# Altium schematic sheet delay_width.SchDoc: Delay and Width Circuit
size Letter; Organization: NewAE Technology Inc.; Address1: 1083 Queen St., Suite 196; Address2: Halifax; Address3: NS; Address4: Canada B3H 0B2; SheetApproved: NO
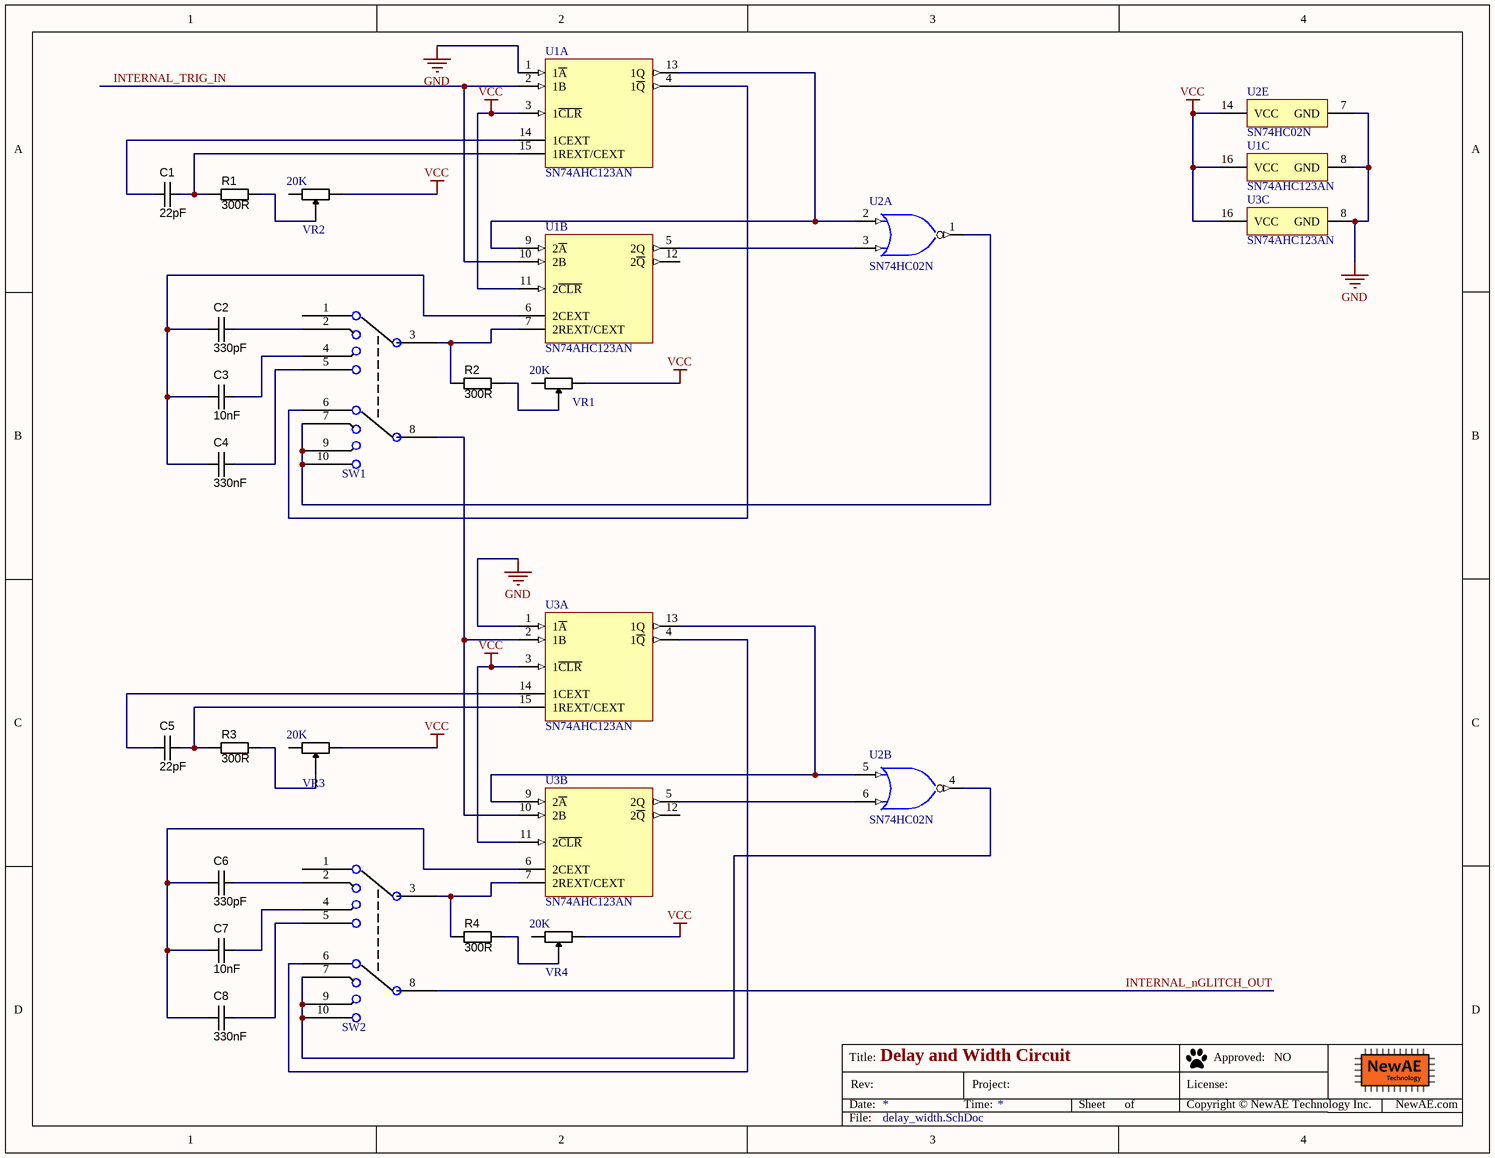
[diagram p0: delay_width.SchDoc]

## Parts
C1  value 22pF  [CAPC500P450250X550]  (hidden comment: approved sub OK)
C2  value 330pF  [CAPC500P450250X550]  (hidden comment: approved sub OK)
C3  value 10nF  [CAPC500P450250X550]  (hidden comment: approved sub OK)
C4  value 330nF  [CAPC500P450250X550]  (hidden comment: approved sub OK)
C5  value 22pF  [CAPC500P450250X550]  (hidden comment: approved sub OK)
C6  value 330pF  [CAPC500P450250X550]  (hidden comment: approved sub OK)
C7  value 10nF  [CAPC500P450250X550]  (hidden comment: approved sub OK)
C8  value 330nF  [CAPC500P450250X550]  (hidden comment: approved sub OK)
R1  value 300R  [RESTH_AXIAL-0.4]  (hidden comment: Carbon Film)
R2  value 300R  [RESTH_AXIAL-0.4]  (hidden comment: Carbon Film)
R3  value 300R  [RESTH_AXIAL-0.4]  (hidden comment: Carbon Film)
R4  value 300R  [RESTH_AXIAL-0.4]  (hidden comment: Carbon Film)
SW1  SS-24E06-TG 5 (P)  [CK_SS24E06TG5P]  (value not drawn)
SW2  SS-24E06-TG 5 (P)  [CK_SS24E06TG5P]  (value not drawn)
U1  SN74AHC123AN  [N0016A]  (parts A,B,C of 3)
U2  SN74HC02N  [N0014A]  (parts A,B,E of 5)
U3  SN74AHC123AN  [N0016A]  (parts A,B,C of 3)
VR1  20K  [RES_PDB18]
VR2  20K  [RES_PDB18]
VR3  20K  [RES_PDB18]
VR4  20K  [RES_PDB18]

## Nets
GND: U1.1(1~{A}) U1.8(GND) U2.7(GND) U3.1(1~{A}) U3.8(GND)
VCC: U1.3(1~{CLR}) U1.11(2~{CLR}) U1.16(VCC) U2.14(VCC) U3.3(1~{CLR}) U3.11(2~{CLR}) U3.16(VCC) VR1.1 VR2.1 VR3.1 VR4.1
INTERNAL_nGLITCH_OUT: SW2.8
INTERNAL_TRIG_IN: U1.2(1B) U1.10(2B)
NetC1_1: C1.1 U1.14(1CEXT)
NetC1_2: C1.2 R1.1 U1.15(1REXT/CEXT)
NetC2_1: C2.1 C3.1 C4.1 U1.6(2CEXT)
NetC2_2: C2.2 SW1.2
NetC3_2: C3.2 SW1.4
NetC4_2: C4.2 SW1.5
NetC5_1: C5.1 U3.14(1CEXT)
NetC5_2: C5.2 R3.1 U3.15(1REXT/CEXT)
NetC6_1: C6.1 C7.1 C8.1 U3.6(2CEXT)
NetC6_2: C6.2 SW2.2
NetC7_2: C7.2 SW2.4
NetC8_2: C8.2 SW2.5
NetR1_2: R1.2 VR2.2
NetR2_1: R2.1 SW1.3 U1.7(2REXT/CEXT)
NetR2_2: R2.2 VR1.2
NetR3_2: R3.2 VR3.2
NetR4_1: R4.1 SW2.3 U3.7(2REXT/CEXT)
NetR4_2: R4.2 VR4.2
NetSW1_6: SW1.6 U1.4(1~{Q})
NetSW1_7: SW1.7 SW1.9 SW1.10 U2.1(1Y)
NetSW1_8: SW1.8 U3.2(1B) U3.10(2B)
NetSW2_6: SW2.6 U3.4(1~{Q})
NetSW2_7: SW2.7 SW2.9 SW2.10 U2.4(2Y)
NetU1_5: U1.5(2Q) U2.3(1B)
NetU1_9: U1.9(2~{A}) U1.13(1Q) U2.2(1A)
NetU2_5: U2.5(2A) U3.9(2~{A}) U3.13(1Q)
NetU2_6: U2.6(2B) U3.5(2Q)

Not connected (* = marked no-connect by the designer): SW1 1; SW2 1; U1 12(2~{Q}); U3 12(2~{Q}); VR1 3; VR2 3; VR3 3; VR4 3

## Notes on the sheet
- Title:
- Date:
- Rev:
- Time:
- Project:
- Sheet
- of
- License:
- Copyright © NewAE Technology Inc.
- Approved:
- NewAE.com
- File:

## Library data of the parts
C1-C8 = CAPR_220n_Radial_5mm: Capacitor Ceramic 220nF 10% 50V X7R radial 5mm lead spacing; Manufacturer 1: TDK Corporation; Ratings: 50V; X7R; SCDType: spec; Tolerance: ±10%; Material: ceramic; Supplier 1: Digi-Key; Package / Case: 0.217" L x 0.177" W (5.50mm x 4.50mm) radial 5mm LS; Operating Temperature: -55°C ~ 125°C; ComponentLink1URL: http://www.tdk.co.jp/tefe02/e4941_fk.pdf; ComponentLink1Description: e4941_fk datasheet
R1-R4 = RES_220R_Axial_0.25W_5%: Resistor THD Axial 220 Ohm 0.25W 5% Carbon Film; Manufacturer 1: Yageo; Manufacturer Part Number 1: CFR-25JB-220R; Ratings: 1/4W; SCDType: spec; Tolerance: ±5%; Package / Case: Axial; Supplier 1: Digi-Key; Supplier Part Number 1: 220QBK-ND
SW1 SW2 = SS24E06TG5P: 2P4T Slide, C&K Through Hole; Manufacture 1: C&K Components; Component Group: Switch; PP Material Stack: 0; Part Number: SS24E06TG5P; Manufacture Part Number 1: SS-24E06-TG 5 (P); Pin Count: 10; Supplier 1: Digi-Key; Supplier Part Number 1: CKN10394-ND; Component Kind: Standard; Component Type: Standard; PP Rotation: 0
U1 U3 = CMP-1629-00116-2: Dual Retriggerable Monostable Multivibrators, N0016A, TUBE; Manufacturer: Texas Instruments; F @ Nom Voltage(Max)(Mhz): 110; Input Type: LVTTL/CMOS; Output Type: CMOS; VCC(Max)(V): 5.5; VCC(Min)(V): 2; Voltage(Nom)(V): 3.3,5; Rating: Catalog; tpd @ Nom Voltage(Max)(ns): 29.5,17; Technology Family: AHC; Schmitt Trigger: No; ICC @ Nom Voltage(Max)(mA): 0.04; Output Drive (IOL/IOH)(Max)(mA): 50/-50; PackageReference: N0016A; Bits(#): 2; Operating Temperature Range(C): -40 to 85; Generic Part Number: SN74AHC123A; Code_JEDEC: MS-001; DatasheetVersion: SCLS352H
U2 = CMP-0806-00198-3: Quadruple 2-Input Positive-NOR Gates, N0014A, TUBE; Manufacturer: Texas Instruments; F @ Nom Voltage(Max)(Mhz): 70; Rating: Catalog; Input Type: CMOS; Voltage(Nom)(V): 5; VCC(Min)(V): 2; Output Drive (IOL/IOH)(Max)(mA): 4/-4; ICC @ Nom Voltage(Max)(mA): 0.02; VCC(Max)(V): 6; Bits(#): 4; tpd @ Nom Voltage(Max)(ns): 23; Operating Temperature Range(C): -40 to 85; PackageVersion: http://www.ti.com/lit/ml/mpdi002c/mpdi002c.pdf; Generic Part Number: SN74HC02; Output Type: CMOS; Code_JEDEC: MS-001; DatasheetVersion: SCLS076E; PackageReference: N0014A
VR1-VR4 = POT_PDB181: POT 1/5W CARBON LINEAR VAR RESISTOR; Manufacture 1: Bourns; Manufacture Part Number 1: PDB181-K420K-203B; PP Material Stack: 0; Part Number: POT_PDB181; Component Group: Resistor; Pin Count: 3; Component Kind: Standard; Component Type: Standard; PP Rotation: 0